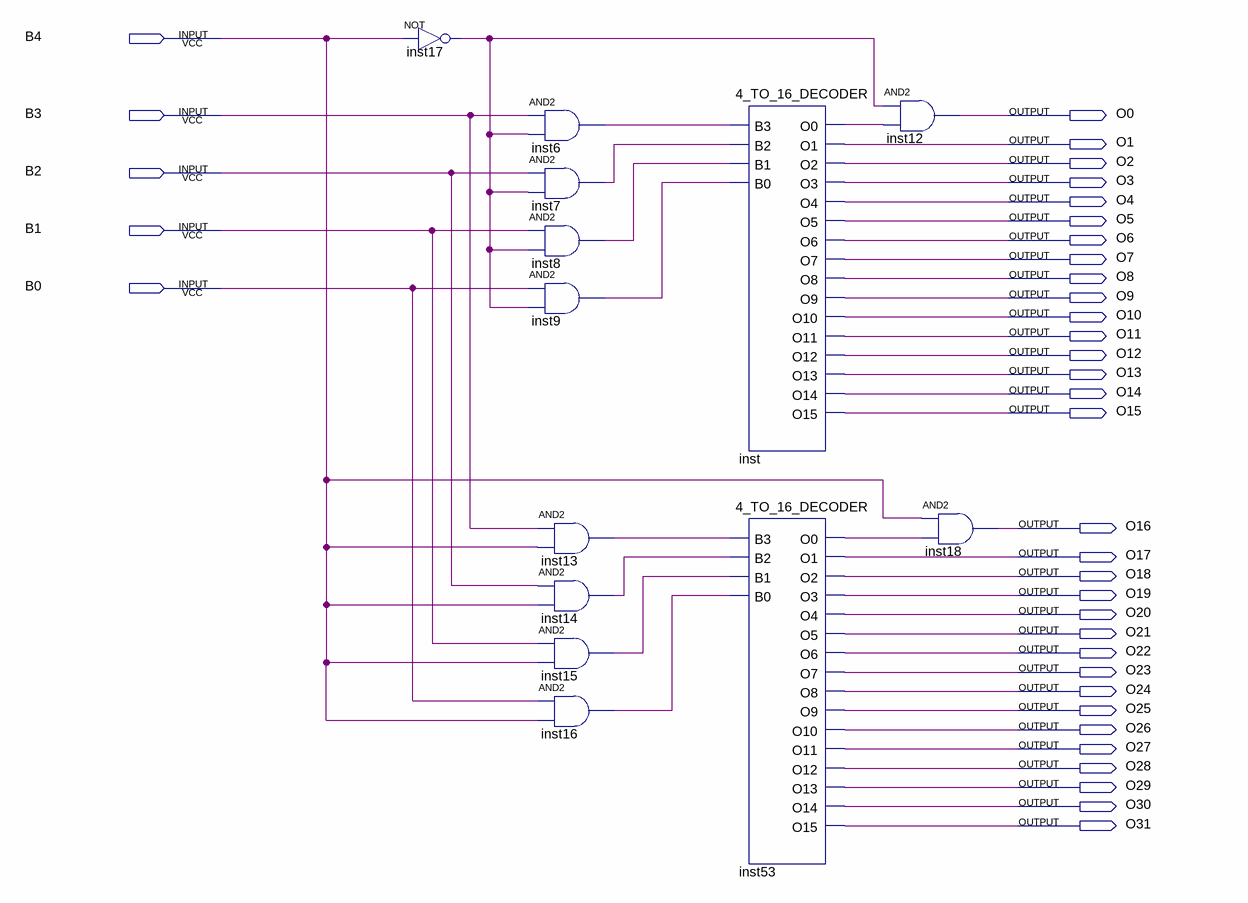
[diagram p0: schematic sheet]
// Quartus schematic 5_TO_32_DECODER.bdf as structural Verilog: 13 symbols, 37 pins
module \5_TO_32_DECODER  (
  input  B4,
  input  B3,
  input  B2,
  input  B1,
  input  B0,
  output O0,
  output O1,
  output O2,
  output O3,
  output O4,
  output O5,
  output O6,
  output O7,
  output O8,
  output O9,
  output O10,
  output O11,
  output O12,
  output O13,
  output O14,
  output O15,
  output O16,
  output O17,
  output O18,
  output O19,
  output O20,
  output O21,
  output O22,
  output O23,
  output O24,
  output O25,
  output O26,
  output O27,
  output O28,
  output O29,
  output O30,
  output O31
);

  wire inst6_out, inst7_out, inst8_out, inst9_out, inst13_out, inst14_out, inst15_out, inst16_out,
       inst17_out, inst53_o0, inst_o0;

  not inst17 (inst17_out, B4);
  and inst6 (inst6_out, B3, inst17_out);
  and inst7 (inst7_out, B2, inst17_out);
  and inst8 (inst8_out, B1, inst17_out);
  and inst9 (inst9_out, B0, inst17_out);
  and inst13 (inst13_out, B3, B4);
  and inst14 (inst14_out, B2, B4);
  and inst15 (inst15_out, B1, B4);
  and inst16 (inst16_out, B0, B4);
  \4_TO_16_DECODER  inst (
    .B3(inst6_out), .B2(inst7_out), .B1(inst8_out), .B0(inst9_out), .O0(inst_o0), .O1(O1), .O2(O2), .O3(O3),
    .O4(O4), .O5(O5), .O6(O6), .O7(O7), .O8(O8), .O9(O9), .O10(O10), .O11(O11), .O12(O12), .O13(O13),
    .O14(O14), .O15(O15));
  \4_TO_16_DECODER  inst53 (
    .B3(inst13_out), .B2(inst14_out), .B1(inst15_out), .B0(inst16_out), .O0(inst53_o0), .O1(O17), .O2(O18),
    .O3(O19), .O4(O20), .O5(O21), .O6(O22), .O7(O23), .O8(O24), .O9(O25), .O10(O26), .O11(O27), .O12(O28),
    .O13(O29), .O14(O30), .O15(O31));
  and inst12 (O0, inst17_out, inst_o0);
  and inst18 (O16, B4, inst53_o0);
endmodule
